# Altium project USBINFRTransiever.PrjPcb
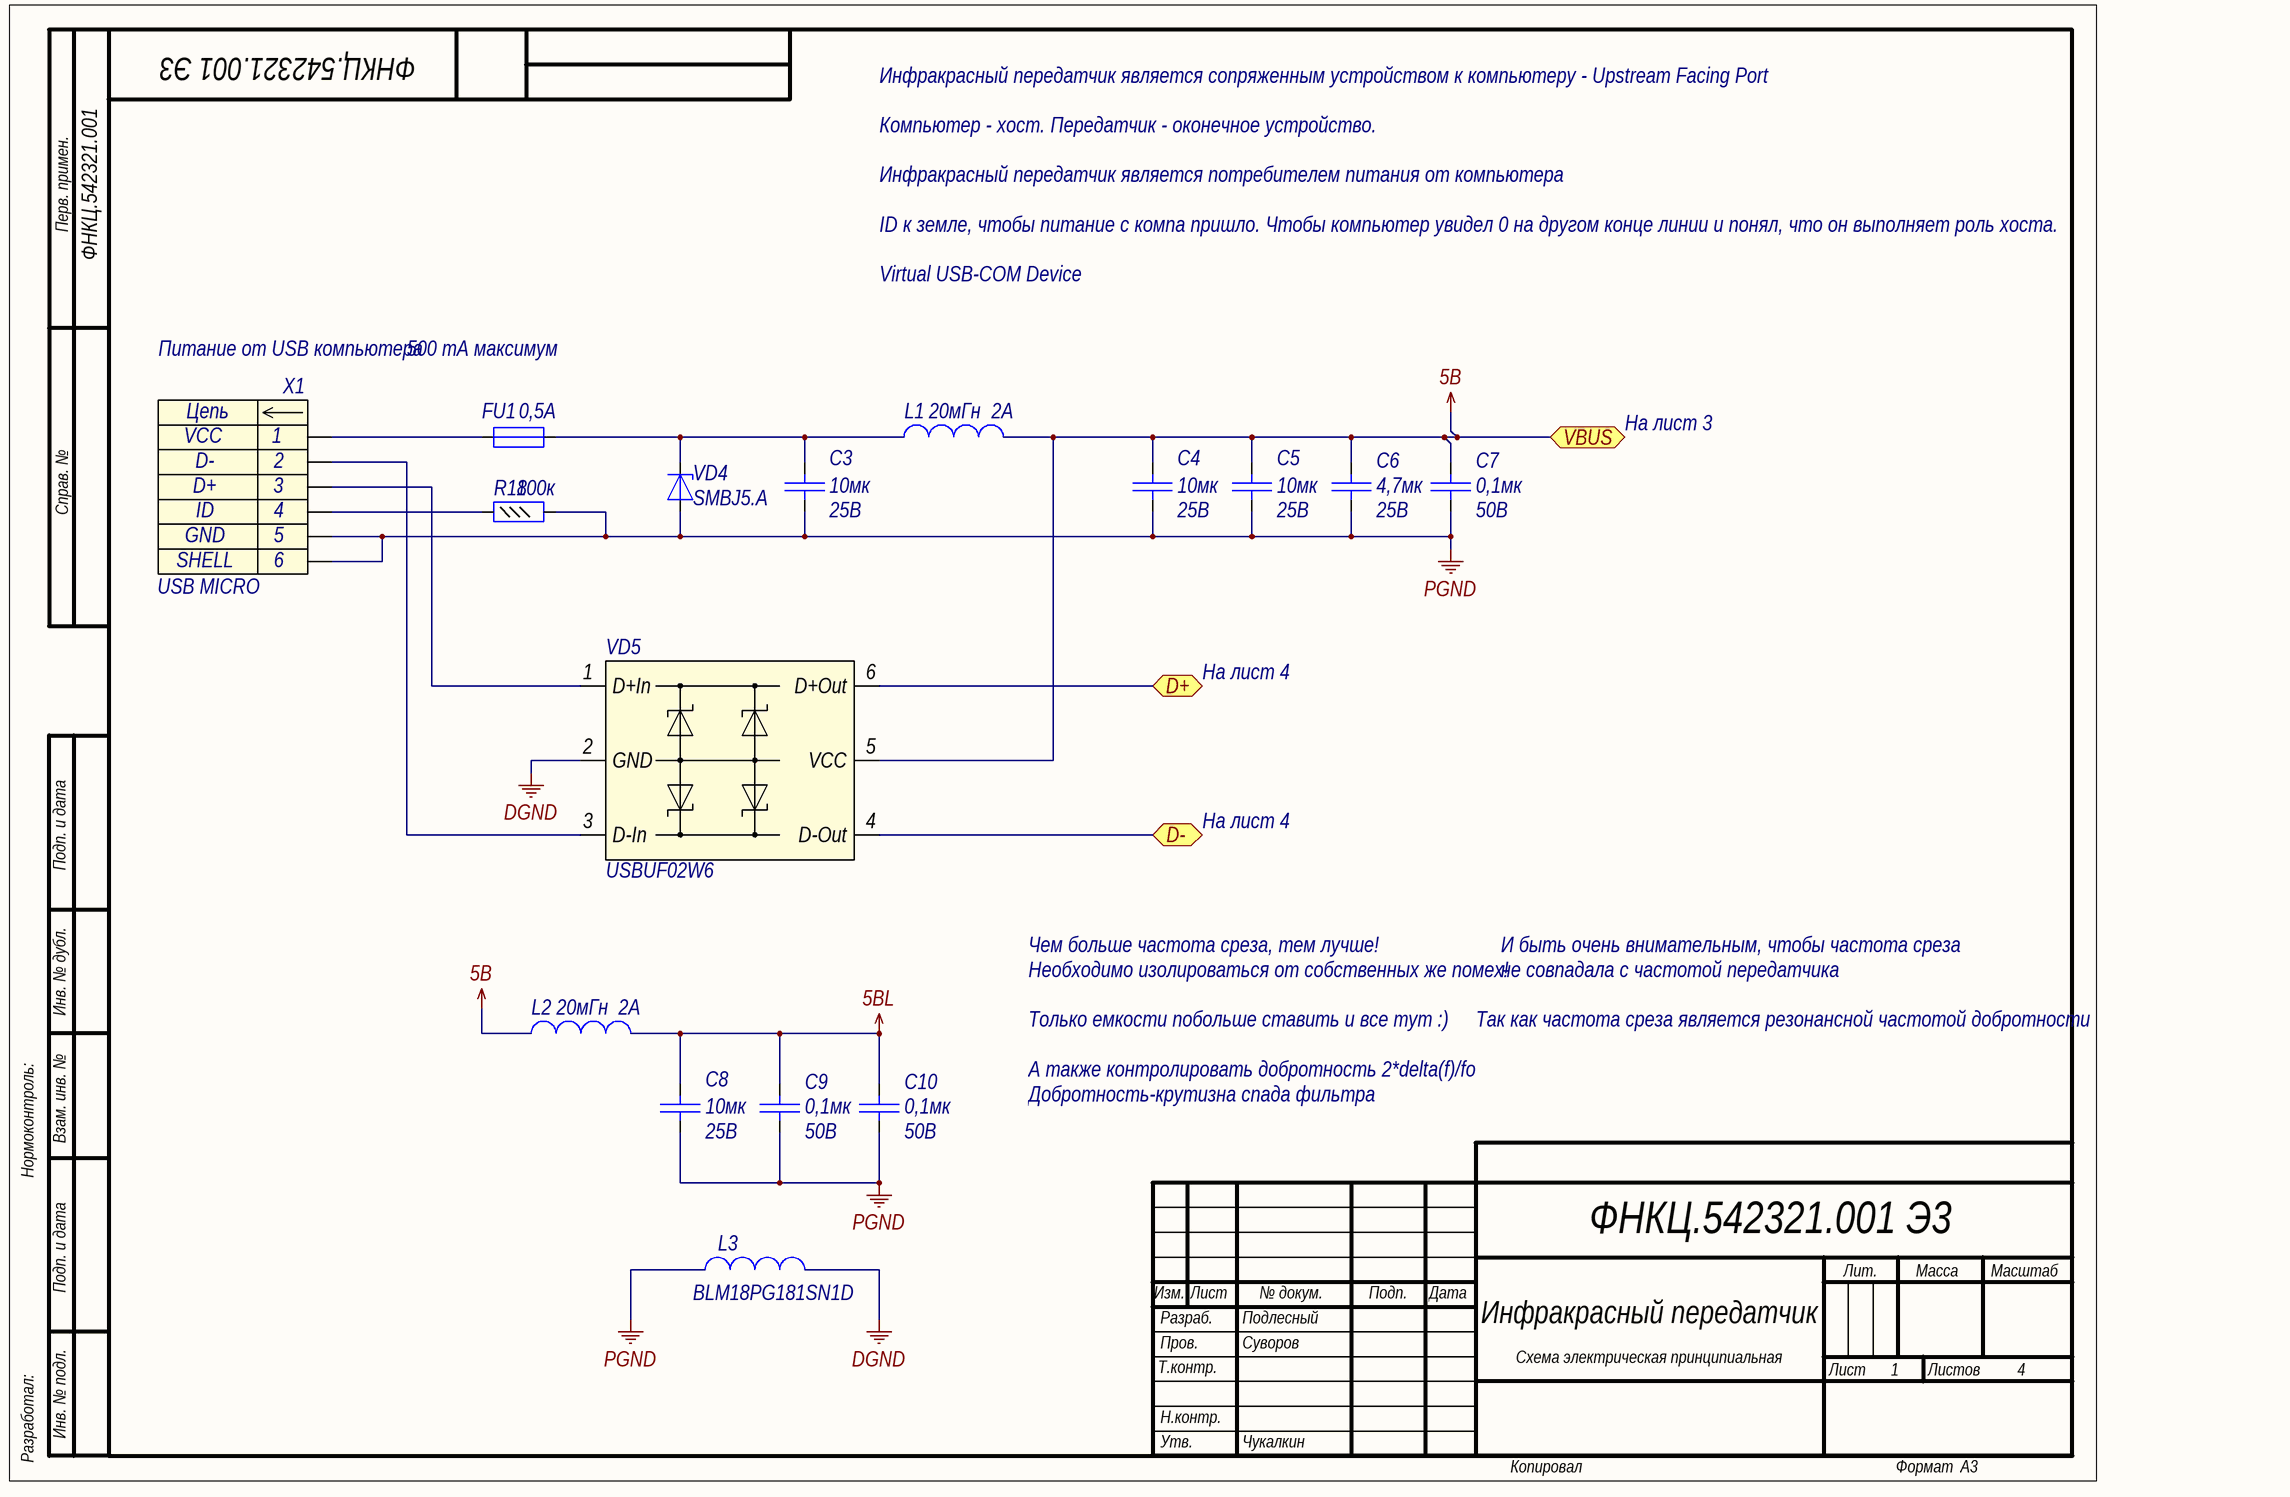
[diagram p0: USBINFRTransiever_POWER.SchDoc]
2 sheets, 21 parts. Net scope: flat (ports and power ports of the same name join across sheets).
Board file: USBINFRTransiever.PcbDoc
Sheets:
  USBINFRTransiever_POWER.SchDoc
  USBINFRTransiever_USBUART.SchDoc

## Sheet USBINFRTransiever_POWER.SchDoc: Инфракрасный передатчик
size 420 x 297 mm; ApprovedBy: Чукалкин; CheckedBy: Суворов; DrawnBy: Подлесный; DocumentNumber: ФНКЦ.542321.001 Э3; SheetNumber: 1; SheetTotal: 4; DocumentType: Схема электрическая принципиальная; Format: A3; ImagePath: ФНКЦ.542321.001

### Parts
C3  value 10мк  Voltage: 25В  [C1206]  (hidden comment: Capacitor)
C4  value 10мк  Voltage: 25В  [C1206]  (hidden comment: Capacitor)
C5  value 10мк  Voltage: 25В  [C1206]  (hidden comment: Capacitor)
C6  value 4,7мк  Voltage: 25B  [C0805]  (hidden comment: Capacitor)
C7  value 0,1мк  Voltage: 50B  [C0805]  (hidden comment: Capacitor)
C8  value 10мк  Voltage: 25В  [C1206]  (hidden comment: Capacitor)
C9  value 0,1мк  Voltage: 50B  [C0805]  (hidden comment: Capacitor)
C10  value 0,1мк  Voltage: 50B  [C0805]  (hidden comment: Capacitor)
FU1  I hold: 0,5A  [FUSE812]  (hidden comment: Fuse)
L1  value 20мГн  Rated Current: 2А  [L0805]  (hidden comment: Inductor)
L2  value 20мГн  Rated Current: 2А  [L0805]  (hidden comment: Inductor)
L3  Part Number: BLM18PG181SN1D  [L0603]  (hidden comment: Inductor)
R18  value 100к  [R0603]  (hidden comment: Resistor_0,062Вт)
VD4  Part Number: SMBJ5.A  [SMB]  (hidden comment: DiodeZener)
VD5  Part Number: USBUF02W6  [SOT323-6L]  (hidden comment: USBUF)
X1  USB MICRO  [47590-0001]

### Ports
D+, D-, VBUS

### Nets
5В: C4.2 C5.2 C6.2 C7.2 L1.2 L2.1 VD5.5(VCC) ; port VBUS
5ВL: C8.2 C9.2 C10.2 L2.2
DGND: L3.2 VD5.2(GND)
PGND: C3.1 C4.1 C5.1 C6.1 C7.1 C8.1 C9.1 C10.1 L3.1 R18.2 VD4.2(A) X1.5 X1.6
NetC3_2: C3.2 FU1.2 L1.1 VD4.1(K)
NetDD1_3: VD5.6(D+Out) ; port D+
NetDD1_4: VD5.4(D-Out) ; port D-
NetFU1_1: FU1.1 X1.1
NetR18_1: R18.1 X1.4
NetVD5_1: VD5.1(D+In) X1.3
NetVD5_3: VD5.3(D-In) X1.2

### Notes on the sheet
- Инфракрасный передатчик является сопряженным устройством к компьютеру - Upstream Facing Port
- Перв. примен.
- Компьютер - хост. Передатчик - оконечное устройство.
- Инфракрасный передатчик является потребителем питания от компьютера
- ID к земле, чтобы питание с компа пришло. Чтобы компьютер увидел 0 на другом конце линии и понял, что он выполняет роль хоста.
- Virtual USB-COM Device
- Питание от USB компьютера
- 500 mA максимум
- На лист 3
- Справ. №
- На лист 4
- Подп. и дата
- Инв. № дубл.
- Чем больше частота среза, тем лучше!
- Необходимо изолироваться от собственных же помех!
- И быть очень внимательным, чтобы частота среза
- не совпадала с частотой передатчика
- Только емкости побольше ставить и все тут :)
- Так как частота среза является резонансной частотой добротности
- Нормоконтроль:
- Взам. инв. №
- А также контролировать добротность 2*delta(f)/fo
- Добротность-крутизна спада фильтра
- Изм.
- Лист
- № докум.
- Подп.
- Дата
- Лит.
- Масса
- Масштаб
- Т.контр.
- Пров.
- Разраб.
- Листов
- Разработал:
- Инв. № подл.
- Н.контр.
- Утв.
- Копировал
- Формат
- (in symbol connect47) Цепь; SHELL

### Library data of the parts
C3-C5 C8 = cap187: Конденсатор; Part Name: Ceramic; Manufacture: Murata; Part Number: GRM31CR71E106KA12L*; id: cap187; TKE: X7R
C6 = cap154: Конденсатор; Part Name: Ceramic; Manufacture: Murata; Part Number: GRM21BR61E475KA12L; id: cap154; TKE: X5R
C7 C9 C10 = cap142: Конденсатор; Part Name: Ceramic; Manufacture: Murata; Part Number: GRM21BR71H104K**; id: cap142; TKE: X7R
FU1 = fuse8: Предохранитель; Part Name: Resettable Fuses; Manufacture: Bourns; Part Number: MF-MSMF050; id: fuse8; V max: 15B; I max: 100A; I trip: 1A; Resistance: 0,15Ohms
L1 L2 = ind69: EMI Suppression Filter; Part Name: EMI Inductor; Part Number: BLM21PG221SN1D; Manufacture: Murata; id: ind69; Resistance: 0,05Ohm
L3 = ind0: EMI Suppression Filter; Part Name: EMI Suppression Filters; id: ind0; Rated Current: 1,5A; Resistance: 0,09Ohm
R18 = res507: Резистор; Manufacture: Yageo; Part Number: RC0603FR-07100KL; id: res507; Accuracy: 1%; Part Name: Resistor; Power: 0,062Вт
VD4 = SMBJ5.A: Cтабилитрон (лавинный выпрямительный диод) односторонний; Part Name: TVS diode Unidirectional; Manufacture: ST Microelectronics; id: tvs68; Leakage Current: 20uA; Stand-off Voltage: 5B; Breakdown Voltage: 6,74B; Clamping voltage: 9,2B; Dynamic resistance: 0,031Ohm; Peak Pulse Power: 600W; Number of diodes: 1
VD5 = diode14: EMEMI filter and line termination for USB upstream ports; Part Name: EMI filter for USB upstream ports; Manufacture: ST Microelectronics; Capacitance: 47pF; Number of Channels: 2; id: diode14
X1 = connect47: Part Name: Micro-USB AB Receptacle; Manufacture1: Molex; Contact_1: VCC; Contact_2: D-; Contact_3: D+; Contact_4: ID; Contact_5: GND; Contact_6: Shell; id: connect47

## Sheet USBINFRTransiever_USBUART.SchDoc
size 420 x 297 mm; DocumentNumber: ФНКЦ.542321.001 Э3; SheetNumber: 4; Format: A3
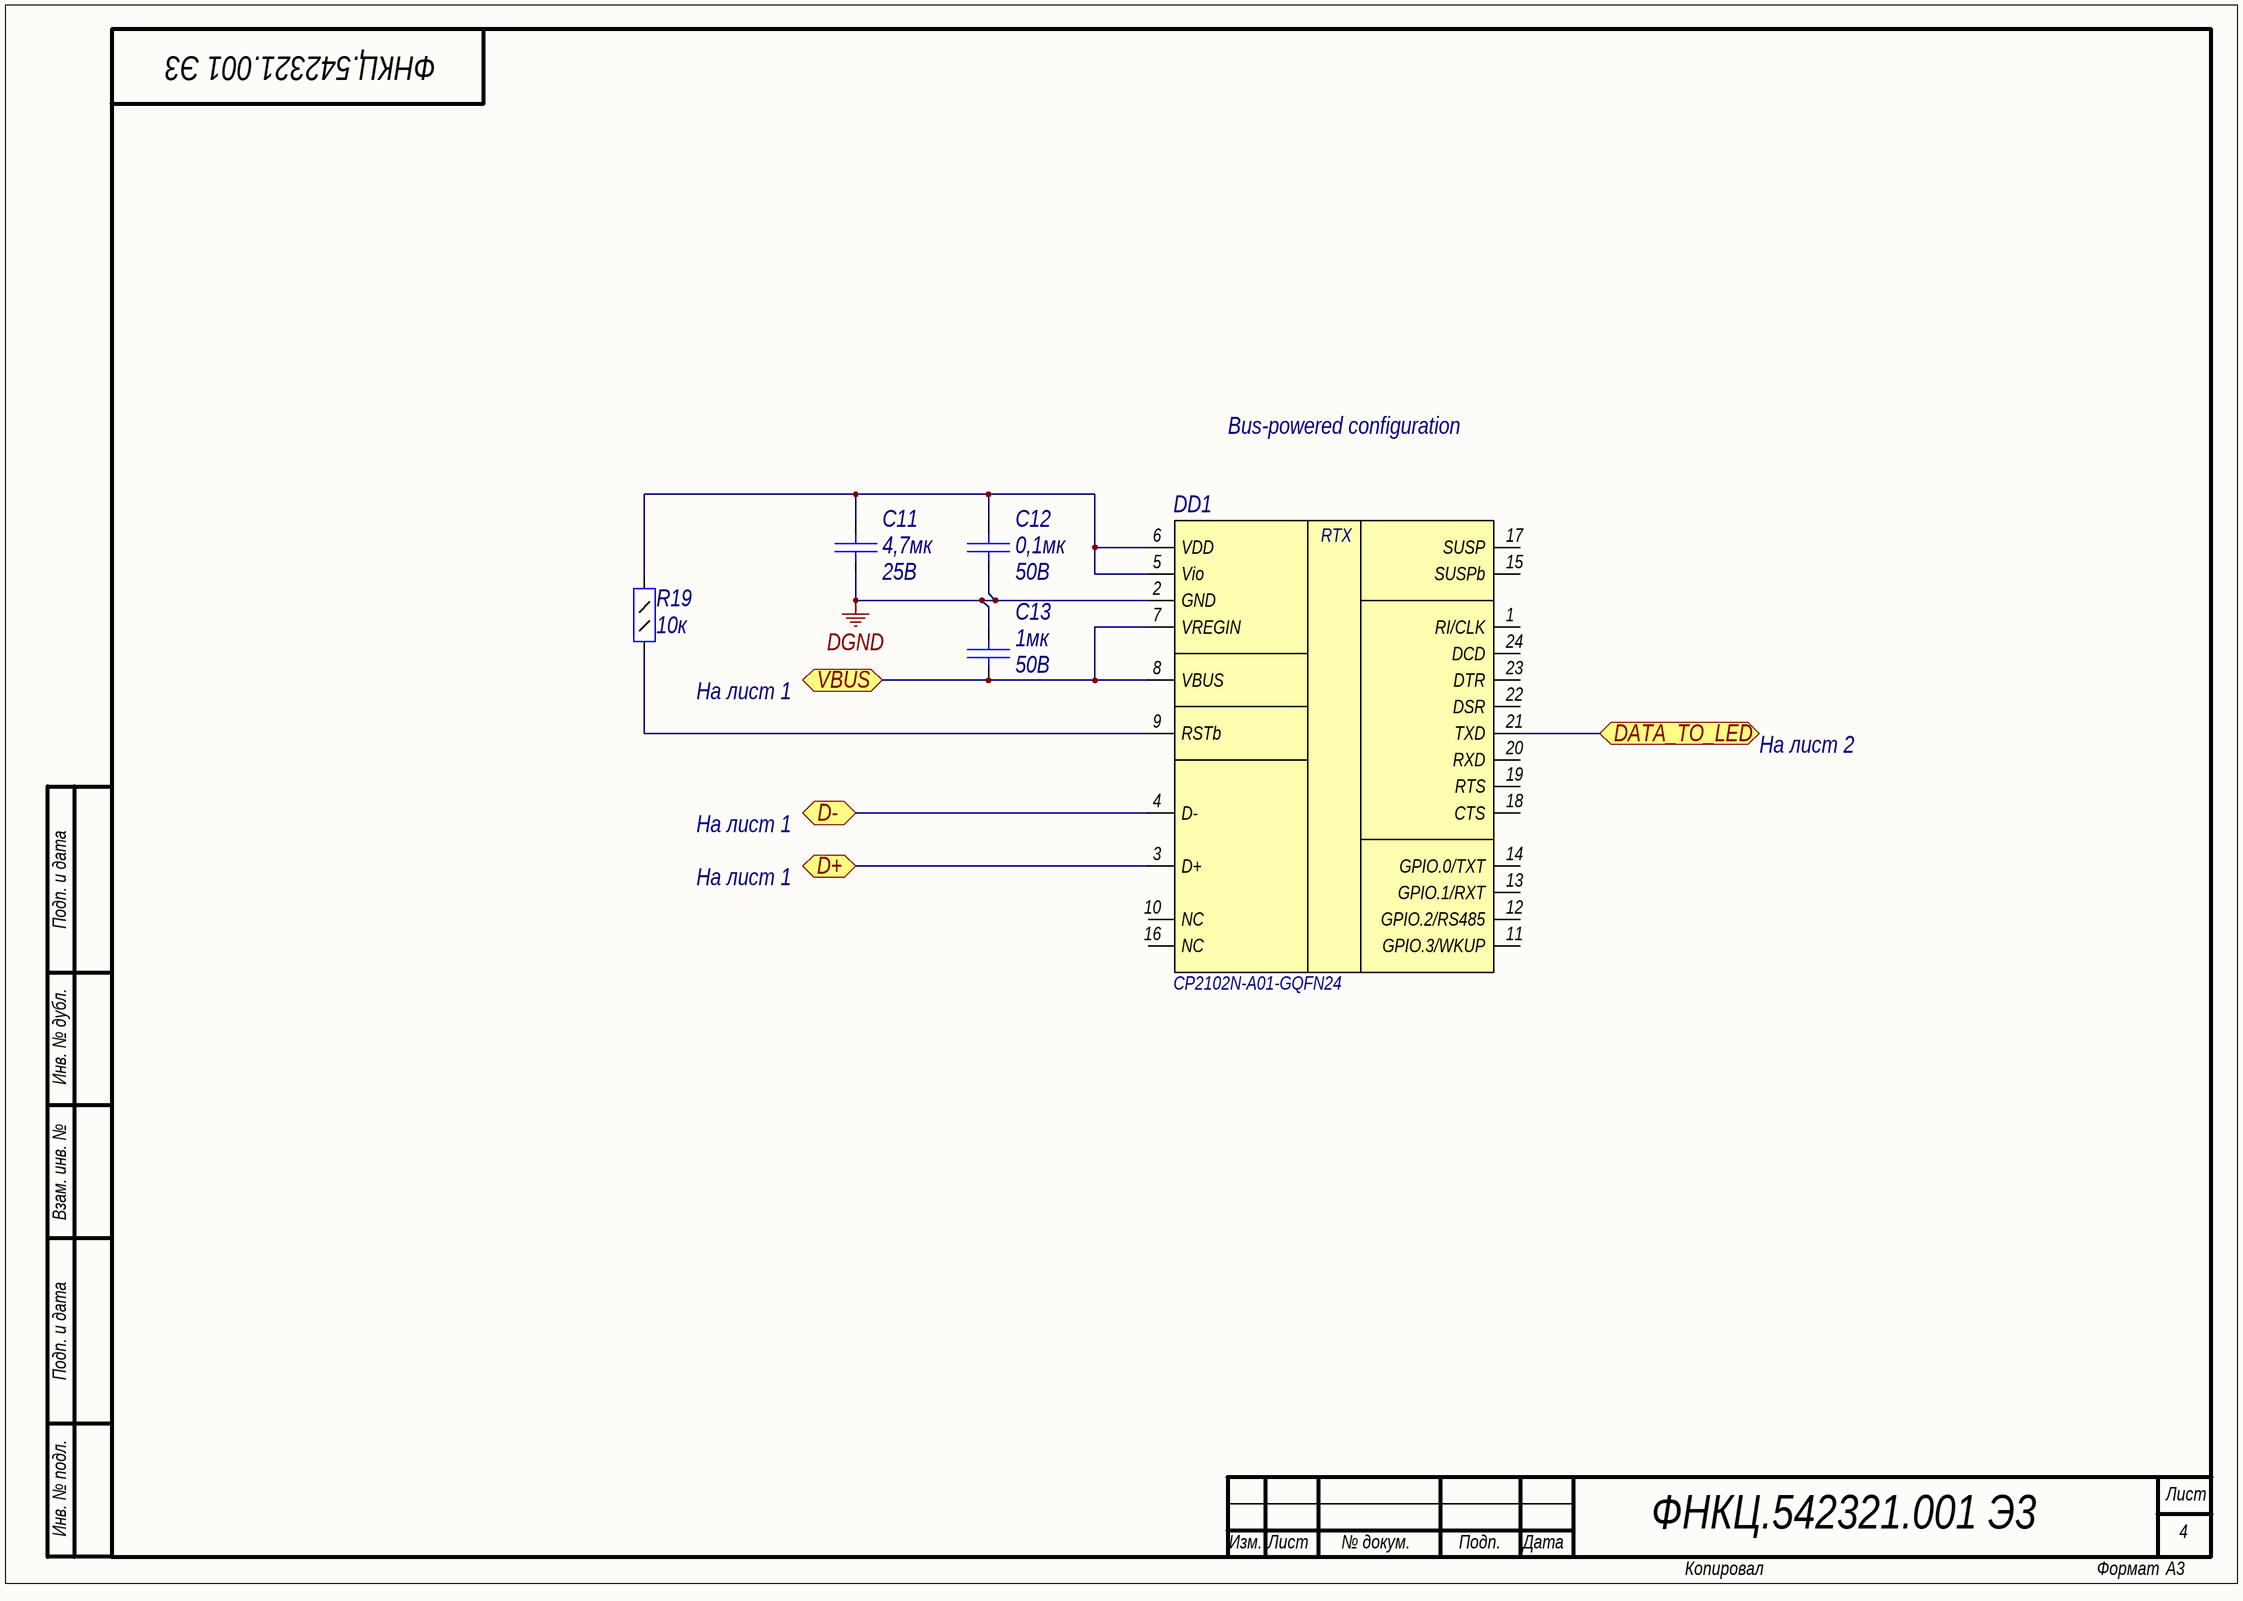
[diagram p1: USBINFRTransiever_USBUART.SchDoc]

### Parts
C11  value 4,7мк  Voltage: 25B  [C0805]  (hidden comment: Capacitor)
C12  value 0,1мк  Voltage: 50B  [C0805]  (hidden comment: Capacitor)
C13  value 1мк  Voltage: 50B  [C0805]  (hidden comment: Capacitor)
DD1  CP2102N-A01-GQFN24  [QFN24]
R19  value 10к  [R0805]  (hidden comment: Resistor_0,125Вт)

### Ports
D+, D-, DATA_TO_LED, VBUS

### Nets
5В: C13.1 DD1.7(VREGIN) DD1.8(VBUS) ; port VBUS
DGND: C11.1 C12.1 C13.2 DD1.2(GND)
NetC11_2: C11.2 C12.2 DD1.5(Vio) DD1.6(VDD) R19.2
NetDD1_3: DD1.3(D+) ; port D+
NetDD1_4: DD1.4(D-) ; port D-
NetDD1_9: DD1.9(RSTb) R19.1
NetDD1_21: DD1.21(TXD) ; port DATA_TO_LED

Not connected (* = marked no-connect by the designer): DD1 1(RI/CLK) 10(NC) 11(GPIO.3/WKUP) 12(GPIO.2/RS485) 13(GPIO.1/RXT) 14(GPIO.0/TXT) 15(SUSPb) 16(NC) 17(SUSP) 18(CTS) 19(RTS) 20(RXD) 22(DSR) 23(DTR) 24(DCD)

### Notes on the sheet
- Bus-powered configuration
- На лист 1
- На лист 2
- Подп. и дата
- Инв. № дубл.
- Взам. инв. №
- Инв. № подл.
- Лист
- Изм.
- № докум.
- Подп.
- Дата
- Копировал
- Формат
- (in symbol interf18) RTX

### Library data of the parts
C11 = cap154: as C6 on sheet USBINFRTransiever_POWER
C12 = cap142: as C7 on sheet USBINFRTransiever_POWER
C13 = cap152: Конденсатор; Part Name: Ceramic; Manufacture: Murata; Part Number: GRM21BR71H105K; id: cap152; TKE: X7R
DD1 = interf18: USB-UART преобразователь; Manufacture: Silicon Laboratories; Type Supply: Single Polar; Current Consumption: 1,3mA...10mA; Power Supply: 3-3.6V; id: interf18; Part Name: USB - UART; Part Number: CP2102N-A01-GQFN24
R19 = res97: Резистор; Manufacture: Yageo; Part Number: RC0805FR-0710KL; id: res97; Accuracy: 1%; Part Name: Resistor; Power: 0,125Вт

## Nets that join several sheets
5В: USBINFRTransiever_POWER (7 pins), USBINFRTransiever_USBUART (C13.1 DD1.7 DD1.8)
DGND: USBINFRTransiever_POWER (L3.2 VD5.2), USBINFRTransiever_USBUART (C11.1 C12.1 C13.2 DD1.2)
NetDD1_3: USBINFRTransiever_POWER (VD5.6), USBINFRTransiever_USBUART (DD1.3)
NetDD1_4: USBINFRTransiever_POWER (VD5.4), USBINFRTransiever_USBUART (DD1.4)